# Altium schematic sheet microcontroller.SchDoc: Microcontroller
size A4; SheetNumber: 3; SheetTotal: 6
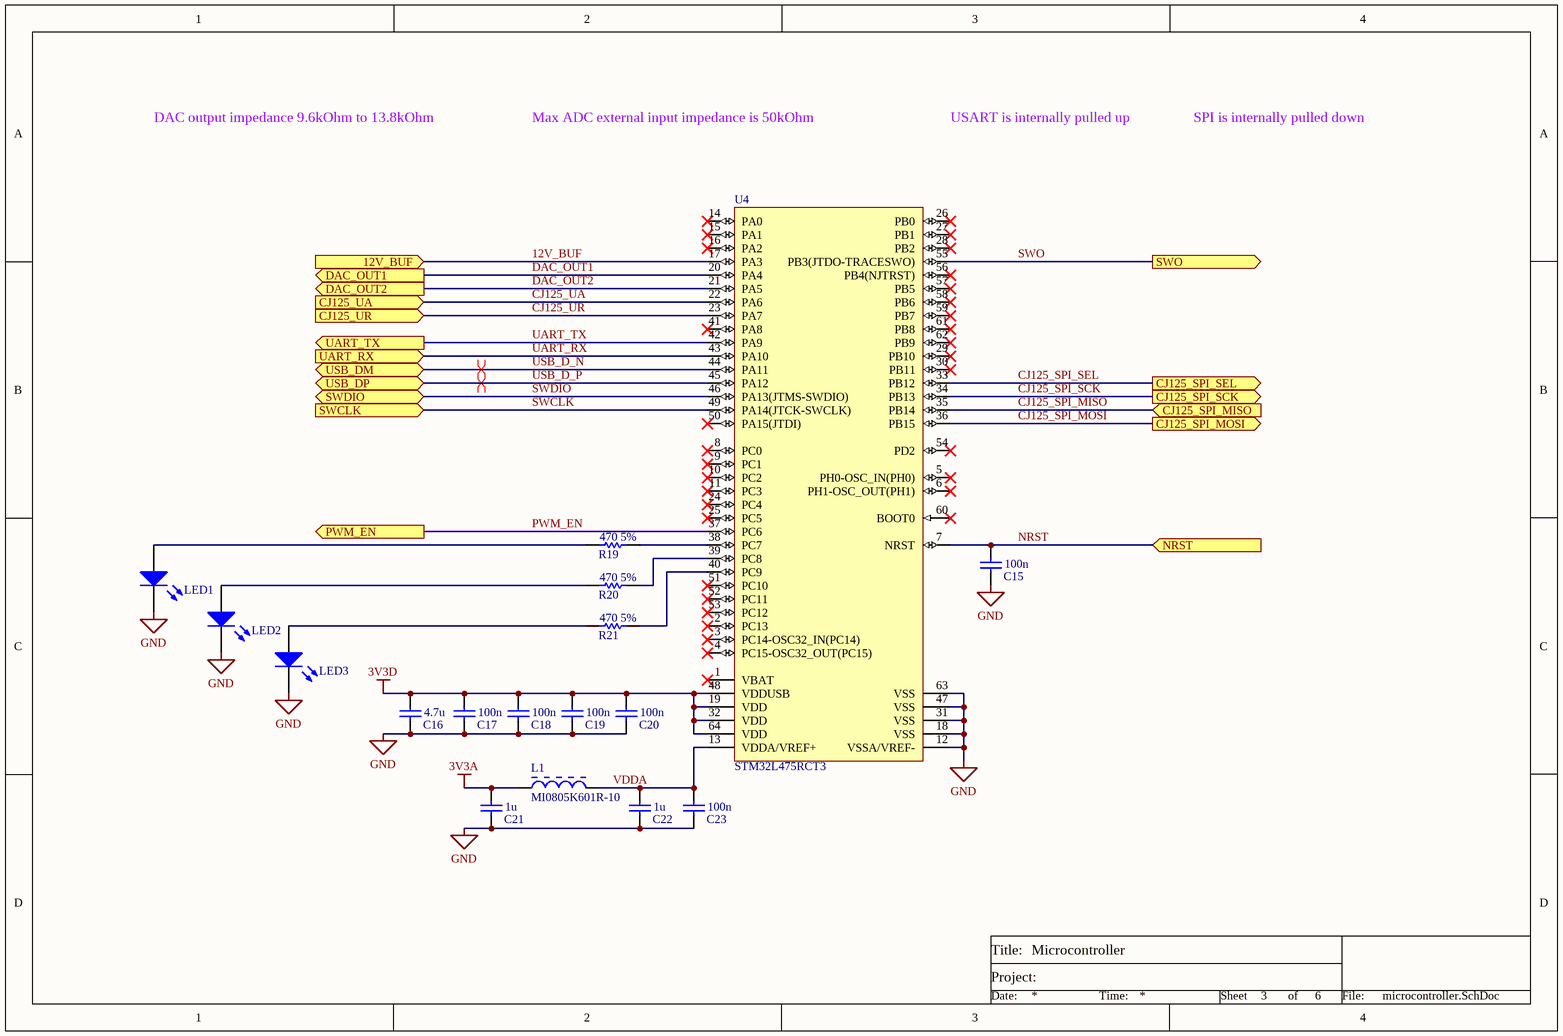
[diagram p0: microcontroller.SchDoc]

## Parts
C15  value 100n  [0805]  (hidden comment: Generic 0805 Capacitor)
C16  value 4.7u  [0805]  (hidden comment: Generic 0805 Capacitor)
C17  value 100n  [0805]  (hidden comment: Generic 0805 Capacitor)
C18  value 100n  [0805]  (hidden comment: Generic 0805 Capacitor)
C19  value 100n  [0805]  (hidden comment: Generic 0805 Capacitor)
C20  value 100n  [0805]  (hidden comment: Generic 0805 Capacitor)
C21  value 1u  [0805]  (hidden comment: Generic 0805 Capacitor)
C22  value 1u  [0805]  (hidden comment: Generic 0805 Capacitor)
C23  value 100n  [0805]  (hidden comment: Generic 0805 Capacitor)
L1  MI0805K601R-10  [0805]
LED1  150080SS75000  [0805_A]  (value not drawn)
LED2  150080SS75000  [0805_A]  (value not drawn)
LED3  150080SS75000  [0805_A]  (value not drawn)
R19  value 470 5%  [0603]  (hidden comment: Generic 0603 Resistor)
R20  value 470 5%  [0603]  (hidden comment: Generic 0603 Resistor)
R21  value 470 5%  [0603]  (hidden comment: Generic 0603 Resistor)
U4  STM32L475RCT3  [STM-LQFP64_L]

## Ports
12V_BUF (in), CJ125_SPI_MISO (in), CJ125_SPI_MOSI (out), CJ125_SPI_SCK (out), CJ125_SPI_SEL (out), CJ125_UA (in), CJ125_UR (in), DAC_OUT1 (out), DAC_OUT2 (out), NRST (in), PWM_EN (out), SWCLK (in), SWDIO (bidir), SWO (out), UART_RX (in), UART_TX (out), USB_DM (bidir), USB_DP (bidir)

## Nets
3V3A: C21.2 L1.1
3V3D: C16.2 C17.2 C18.2 C19.2 C20.2 U4.19(VDD) U4.32(VDD) U4.48(VDDUSB) U4.64(VDD)
GND: C15.1 C16.1 C17.1 C18.1 C19.1 C20.1 C21.1 C22.1 C23.1 LED1.1(K) LED2.1(K) LED3.1(K) U4.12(VSSA/VREF-) U4.18(VSS) U4.31(VSS) U4.47(VSS) U4.63(VSS)
12V_BUF: U4.17(PA3) ; port 12V_BUF
CJ125_SPI_MISO: U4.35(PB14) ; port CJ125_SPI_MISO
CJ125_SPI_MOSI: U4.36(PB15) ; port CJ125_SPI_MOSI
CJ125_SPI_SCK: U4.34(PB13) ; port CJ125_SPI_SCK
CJ125_SPI_SEL: U4.33(PB12) ; port CJ125_SPI_SEL
CJ125_UA: U4.22(PA6) ; port CJ125_UA
CJ125_UR: U4.23(PA7) ; port CJ125_UR
DAC_OUT1: U4.20(PA4) ; port DAC_OUT1
DAC_OUT2: U4.21(PA5) ; port DAC_OUT2
NRST: C15.2 U4.7(NRST) ; port NRST
PWM_EN: U4.37(PC6) ; port PWM_EN
SWCLK: U4.49(PA14(JTCK-SWCLK)) ; port SWCLK
SWDIO: U4.46(PA13(JTMS-SWDIO)) ; port SWDIO
SWO: U4.55(PB3(JTDO-TRACESWO)) ; port SWO
UART_RX: U4.43(PA10) ; port UART_RX
UART_TX: U4.42(PA9) ; port UART_TX
USB_D_N: U4.44(PA11) ; port USB_DM
USB_D_P: U4.45(PA12) ; port USB_DP
VDDA: C22.2 C23.2 L1.2 U4.13(VDDA/VREF+)
NetLED1_2: LED1.2(A) R19.1
NetLED2_2: LED2.2(A) R20.1
NetLED3_2: LED3.2(A) R21.1
NetR19_2: R19.2 U4.38(PC7)
NetR20_2: R20.2 U4.39(PC8)
NetR21_2: R21.2 U4.40(PC9)

Not connected (* = marked no-connect by the designer): U4 1(VBAT)* 2(PC13)* 3(PC14-OSC32_IN(PC14))* 4(PC15-OSC32_OUT(PC15))* 5(PH0-OSC_IN(PH0))* 6(PH1-OSC_OUT(PH1))* 8(PC0)* 9(PC1)* 10(PC2)* 11(PC3)* 14(PA0)* 15(PA1)* 16(PA2)* 24(PC4)* 25(PC5)* 26(PB0)* 27(PB1)* 28(PB2)* 29(PB10)* 30(PB11)* 41(PA8)* 50(PA15(JTDI))* 51(PC10)* 52(PC11)* 53(PC12)* 54(PD2)* 56(PB4(NJTRST))* 57(PB5)* 58(PB6)* 59(PB7)* 60(BOOT0)* 61(PB8)* 62(PB9)*

## Layout directives
differential pair: USB_D_N, USB_D_P

## Notes on the sheet
- DAC output impedance 9.6kOhm to 13.8kOhm
- Max ADC external input impedance is 50kOhm
- USART is internally pulled up
- SPI is internally pulled down
- Title
- Title:
- Project:
- Size:
- Date:
- File:
- E
- Number:
- Time:
- Revision:
- Sheet
- of

## Library data of the parts
C15-C23 = C_0805: Specifications: *
L1 = MI0805K: Chip Bead for Power Filtering, 1500 mA, 600 Ohm, -40 to 125 degC, 0805 (2012 Metric), RoHS, Tape and Reel; Manufacturer: Laird; Filter Type: PowerLine; Current Rating (Max): 1.5A; Catalog Drawings: (HI,HZ,LI,MI)0805Series_1.10mmMax.Height; Impedance @ Frequency: 600Ohm@100MHz; Number of Lines: 1; DC Resistance (DCR) (Max): 100mOhm; Other Names: 240-2390-1; Kits: 240-2227-ND-KITEMIFERRITEBEADCHIPSMD; Online Catalog: MISeries; Standard Package: 1; Datasheet Version: Rev. A, 01/2004; Height (Max): 0.043"(1.10mm); Category: Filters; Operating Temperature: -40degC~125degC; Package Description: 2-Pin Surface Mount Device, Body 2 x 1.25 mm; Package / Case: 0805(2012Metric); Package Reference: MI0805K601R-10-2; Packaging: CutTape(CT); Ratings: -; Mounting Type: SurfaceMount; Datasheet URL: https://datasheet.ciiva.com/3082/mi0805k601r-10-a-vp-3082219.pdf; Size / Dimension: 0.079"Lx0.049"W(2.00mmx1.25mm); Family: FerriteBeadsandChips; Manufacturer URL: https://www.lairdtech.com; Series: MI
LED1-LED3 = LED_0805: SMD mono-color Chip LED, WL-SMCW, Super Red; Manufacturer: Wuerth Elektronik; PackageReference: 0805_A; ComponentLink2URL: http://katalog.we-online.com/led/datasheet/150080SS75000.pdf; ComponentLink1URL: http://www.we-online.com; Color: Super Red; ComponentLink2Description: Datasheet; ComponentLink1Description: Manufacturer URL; PartNumber: 150080SS75000
R19-R21 = R_0603: Specifications: *
U4 = STM32L475RCT3: Ultra-Low-Power ARM Cortex-M4 32-bit MCU+FPU, 256 KB Flash, 128 KB Internal RAM, 51 I/Os, 64-Pin LQFP, -40 to 125 degC, Tray; Operating Frequency(F) (Processor speed) (MHz): 80; Internal RAM Size (kB): 128; I/Os (High Current): 51; D/A Converter: 2; Supply Voltage(Vcc) min (V): 1.71; FLASH Size (Prog) (kB): 256; Package: LQFP64; Packing: Tray; DatasheetVersion: Rev. 4; Mounting Technology: Surface Mount; Core: ARM Cortex-M4; Package Description: 64-Pin Low-profile Quad Flat Package, Body 10 x 10 mm, Pitch 0.5 mm; ComponentLink1Description: Datasheet; ComponentLink1URL: http://www.st.com/content/ccc/resource/technical/document/datasheet/90/51/73/d2/53/60/4f/5f/DM00172872.pdf/files/DM00172872.pdf/jcr:content/translations/en.DM00172872.pdf; Supplier 1: Digi-Key; Supplier Part Number 1: 497-16840-ND